# Altium schematic sheet LPDDR4 SDRAM - 1.SchDoc: RK3399 SOM Module
size A3; Date: 23.05.2023; Author: Łukasz Nowarkiewicz; SheetNumber: 1; SheetTotal: 21; RegistrationBookNumber: 144201; title_sheet: LPDDR4 SDRAM - 1
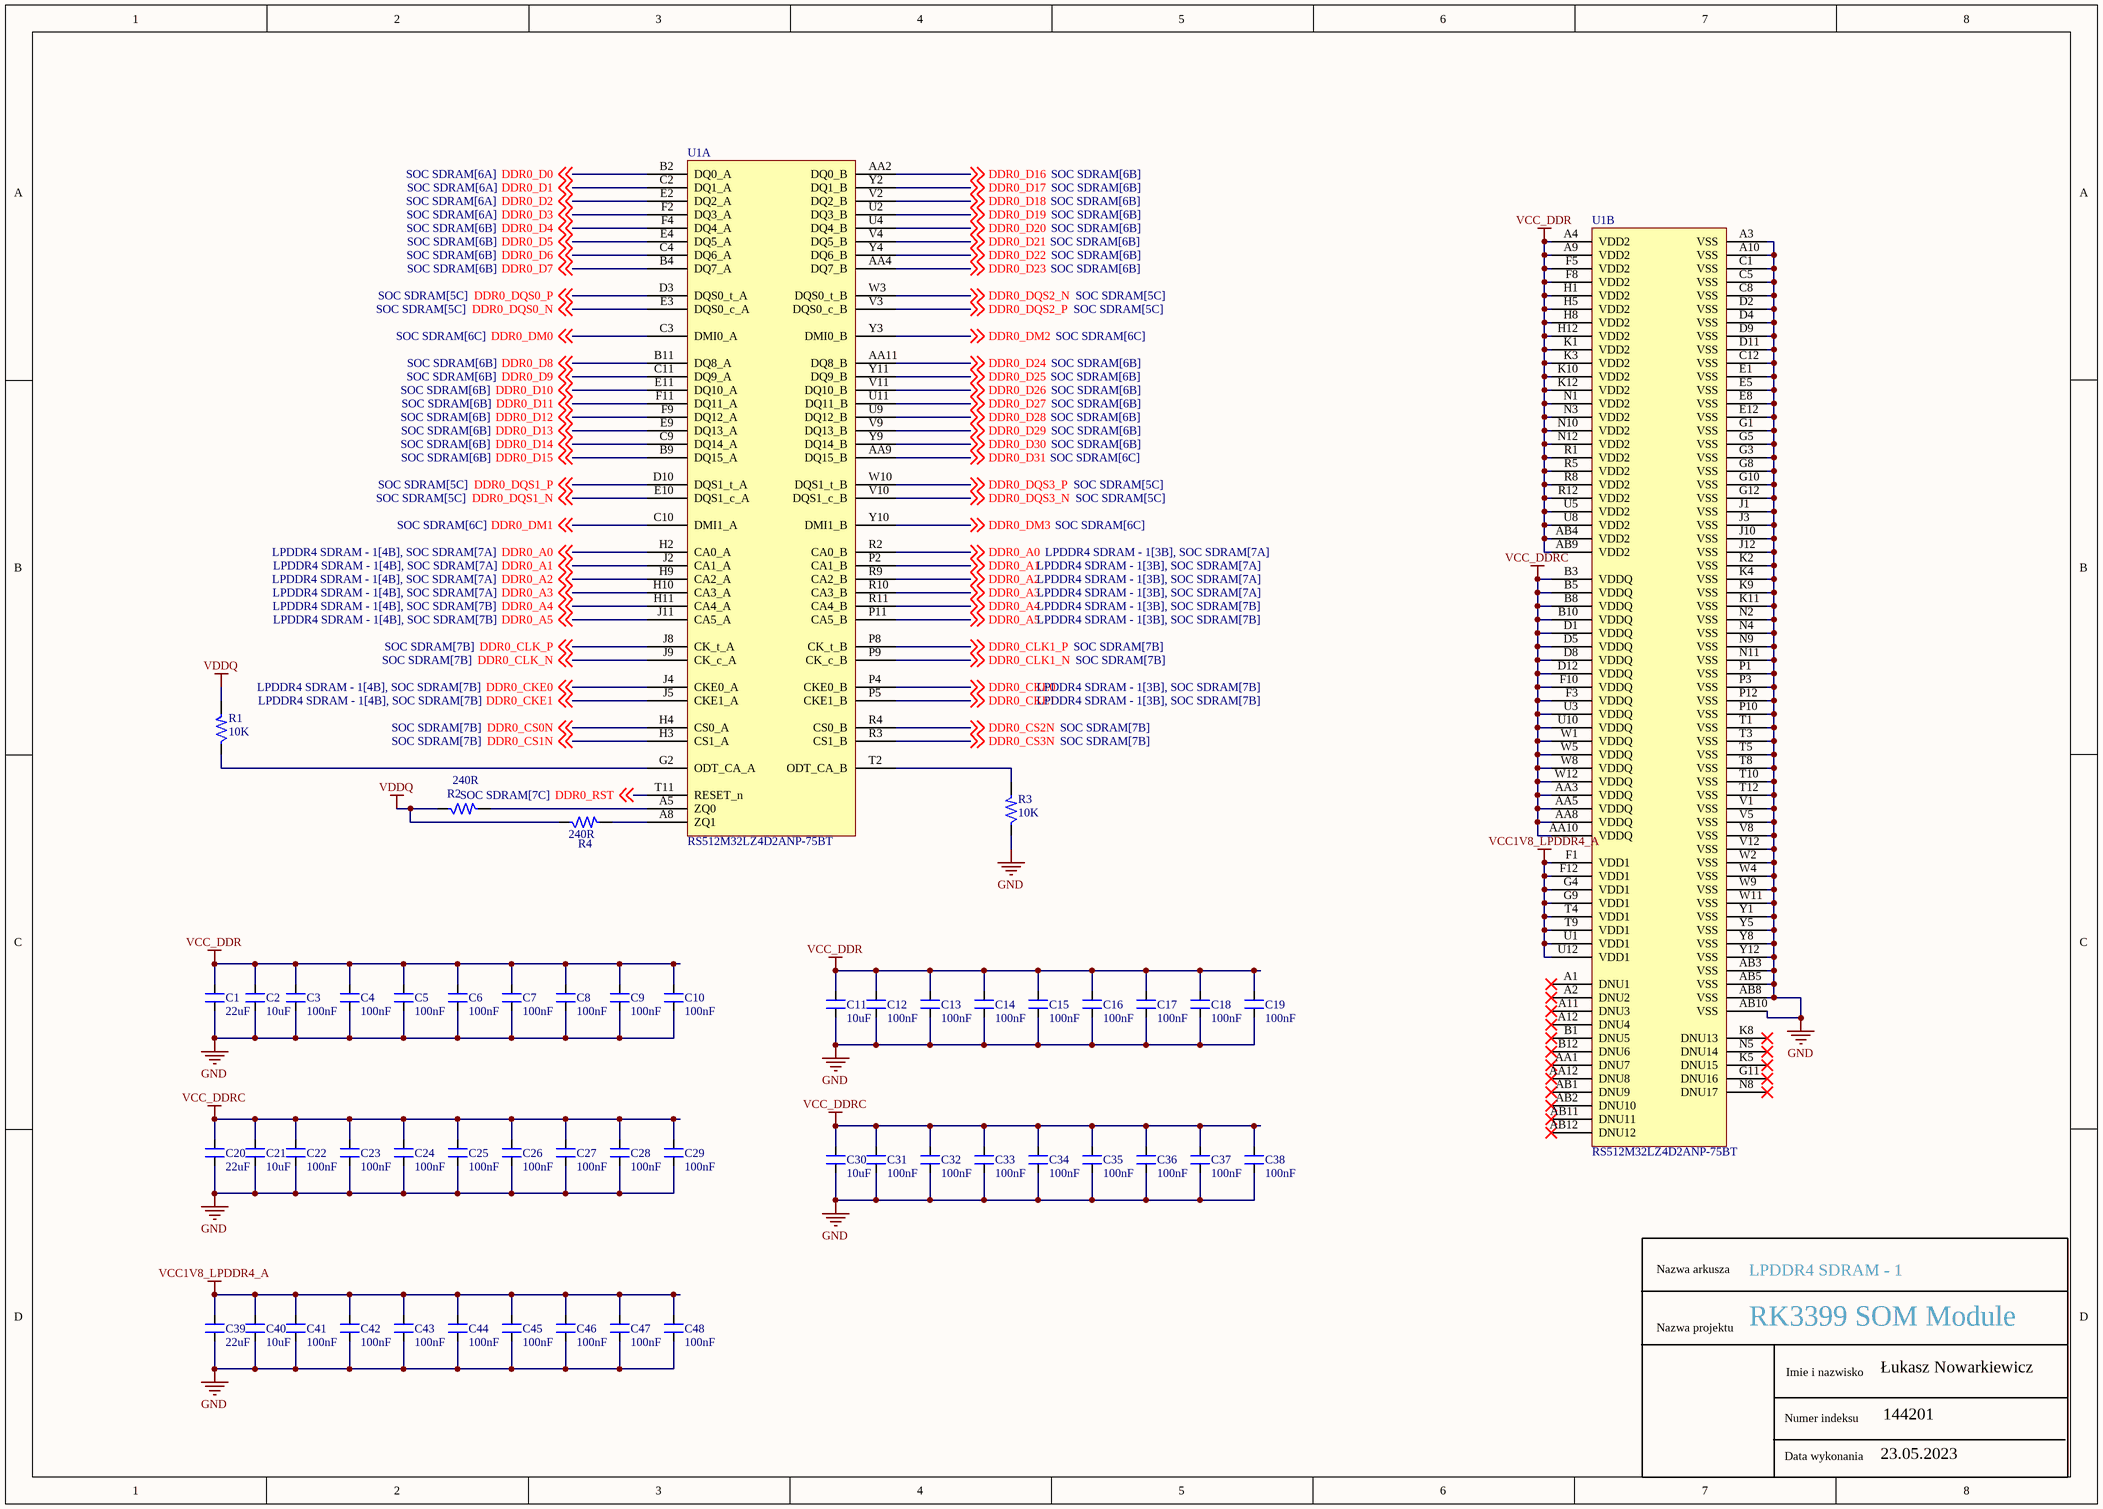
[diagram p0: LPDDR4 SDRAM - 1.SchDoc]

## Parts
C1  22uF  [CAP_0603]
C2  10uF  [CAP_0603]
C3  100nF  [CAP_0402]
C4  100nF  [CAP_0402]
C5  100nF  [CAP_0402]
C6  100nF  [CAP_0402]
C7  100nF  [CAP_0402]
C8  100nF  [CAP_0402]
C9  100nF  [CAP_0402]
C10  100nF  [CAP_0402]
C11  10uF  [CAP_0603]
C12  100nF  [CAP_0402]
C13  100nF  [CAP_0402]
C14  100nF  [CAP_0402]
C15  100nF  [CAP_0402]
C16  100nF  [CAP_0402]
C17  100nF  [CAP_0402]
C18  100nF  [CAP_0402]
C19  100nF  [CAP_0402]
C20  22uF  [CAP_0603]
C21  10uF  [CAP_0603]
C22  100nF  [CAP_0402]
C23  100nF  [CAP_0402]
C24  100nF  [CAP_0402]
C25  100nF  [CAP_0402]
C26  100nF  [CAP_0402]
C27  100nF  [CAP_0402]
C28  100nF  [CAP_0402]
C29  100nF  [CAP_0402]
C30  10uF  [CAP_0603]
C31  100nF  [CAP_0402]
C32  100nF  [CAP_0402]
C33  100nF  [CAP_0402]
C34  100nF  [CAP_0402]
C35  100nF  [CAP_0402]
C36  100nF  [CAP_0402]
C37  100nF  [CAP_0402]
C38  100nF  [CAP_0402]
C39  22uF  [CAP_0603]
C40  10uF  [CAP_0603]
C41  100nF  [CAP_0402]
C42  100nF  [CAP_0402]
C43  100nF  [CAP_0402]
C44  100nF  [CAP_0402]
C45  100nF  [CAP_0402]
C46  100nF  [CAP_0402]
C47  100nF  [CAP_0402]
C48  100nF  [CAP_0402]
R1  10K  [RES_0201]
R2  240R  [RES_0201]
R3  10K  [RES_0201]
R4  240R  [RES_0201]
U1  RS512M32LZ4D2ANP-75BT  [FBGA200_SMD]  (parts A,B of 2)

## Nets
GND: C1.1 C2.1 C3.1 C4.1 C5.1 C6.1 C7.1 C8.1 C9.1 C10.1 C11.1 C12.1 C13.1 C14.1 C15.1 C16.1 C17.1 C18.1 C19.1 C20.1 C21.1 C22.1 C23.1 C24.1 C25.1 C26.1 C27.1 C28.1 C29.1 C30.1 C31.1 C32.1 C33.1 C34.1 C35.1 C36.1 C37.1 C38.1 C39.1 C40.1 C41.1 C42.1 C43.1 C44.1 C45.1 C46.1 C47.1 C48.1 R3.1 U1.A3(VSS) U1.A10(VSS) U1.AB3(VSS) U1.AB5(VSS) U1.AB8(VSS) U1.AB10(VSS) U1.C1(VSS) U1.C5(VSS) U1.C8(VSS) U1.C12(VSS) U1.D2(VSS) U1.D4(VSS) U1.D9(VSS) U1.D11(VSS) U1.E1(VSS) U1.E5(VSS) U1.E8(VSS) U1.E12(VSS) U1.G1(VSS) U1.G3(VSS) U1.G5(VSS) U1.G8(VSS) U1.G10(VSS) U1.G12(VSS) U1.J1(VSS) U1.J3(VSS) U1.J10(VSS) U1.J12(VSS) U1.K2(VSS) U1.K4(VSS) U1.K9(VSS) U1.K11(VSS) U1.N2(VSS) U1.N4(VSS) U1.N9(VSS) U1.N11(VSS) U1.P1(VSS) U1.P3(VSS) U1.P10(VSS) U1.P12(VSS) U1.T1(VSS) U1.T3(VSS) U1.T5(VSS) U1.T8(VSS) U1.T10(VSS) U1.T12(VSS) U1.V1(VSS) U1.V5(VSS) U1.V8(VSS) U1.V12(VSS) U1.W2(VSS) U1.W4(VSS) U1.W9(VSS) U1.W11(VSS) U1.Y1(VSS) U1.Y5(VSS) U1.Y8(VSS) U1.Y12(VSS)
VCC1V8_LPDDR4_A: C39.2 C40.2 C41.2 C42.2 C43.2 C44.2 C45.2 C46.2 C47.2 C48.2 U1.F1(VDD1) U1.F12(VDD1) U1.G4(VDD1) U1.G9(VDD1) U1.T4(VDD1) U1.T9(VDD1) U1.U1(VDD1) U1.U12(VDD1)
VCC_DDR: C1.2 C2.2 C3.2 C4.2 C5.2 C6.2 C7.2 C8.2 C9.2 C10.2 C11.2 C12.2 C13.2 C14.2 C15.2 C16.2 C17.2 C18.2 C19.2 U1.A4(VDD2) U1.A9(VDD2) U1.AB4(VDD2) U1.AB9(VDD2) U1.F5(VDD2) U1.F8(VDD2) U1.H1(VDD2) U1.H5(VDD2) U1.H8(VDD2) U1.H12(VDD2) U1.K1(VDD2) U1.K3(VDD2) U1.K10(VDD2) U1.K12(VDD2) U1.N1(VDD2) U1.N3(VDD2) U1.N10(VDD2) U1.N12(VDD2) U1.R1(VDD2) U1.R5(VDD2) U1.R8(VDD2) U1.R12(VDD2) U1.U5(VDD2) U1.U8(VDD2)
VCC_DDRC: C20.2 C21.2 C22.2 C23.2 C24.2 C25.2 C26.2 C27.2 C28.2 C29.2 C30.2 C31.2 C32.2 C33.2 C34.2 C35.2 C36.2 C37.2 C38.2 U1.AA3(VDDQ) U1.AA5(VDDQ) U1.AA8(VDDQ) U1.AA10(VDDQ) U1.B3(VDDQ) U1.B5(VDDQ) U1.B8(VDDQ) U1.B10(VDDQ) U1.D1(VDDQ) U1.D5(VDDQ) U1.D8(VDDQ) U1.D12(VDDQ) U1.F3(VDDQ) U1.F10(VDDQ) U1.U3(VDDQ) U1.U10(VDDQ) U1.W1(VDDQ) U1.W5(VDDQ) U1.W8(VDDQ) U1.W12(VDDQ)
VDDQ: R1.2 R2.1 R4.1
DDR0_A0: U1.H2(CA0_A) U1.R2(CA0_B) ; off-sheet DDR0_A0
DDR0_A1: U1.J2(CA1_A) U1.P2(CA1_B) ; off-sheet DDR0_A1
DDR0_A2: U1.H9(CA2_A) U1.R9(CA2_B) ; off-sheet DDR0_A2
DDR0_A3: U1.H10(CA3_A) U1.R10(CA3_B) ; off-sheet DDR0_A3
DDR0_A4: U1.H11(CA4_A) U1.R11(CA4_B) ; off-sheet DDR0_A4
DDR0_A5: U1.J11(CA5_A) U1.P11(CA5_B) ; off-sheet DDR0_A5
DDR0_CKE0: U1.J4(CKE0_A) U1.P4(CKE0_B) ; off-sheet DDR0_CKE0
DDR0_CKE1: U1.J5(CKE1_A) U1.P5(CKE1_B) ; off-sheet DDR0_CKE1
DDR0_CLK1_N: U1.P9(CK_c_B) ; off-sheet DDR0_CLK1_N
DDR0_CLK1_P: U1.P8(CK_t_B) ; off-sheet DDR0_CLK1_P
DDR0_CLK_N: U1.J9(CK_c_A) ; off-sheet DDR0_CLK_N
DDR0_CLK_P: U1.J8(CK_t_A) ; off-sheet DDR0_CLK_P
DDR0_CS0N: U1.H4(CS0_A) ; off-sheet DDR0_CS0N
DDR0_CS1N: U1.H3(CS1_A) ; off-sheet DDR0_CS1N
DDR0_CS2N: U1.R4(CS0_B) ; off-sheet DDR0_CS2N
DDR0_CS3N: U1.R3(CS1_B) ; off-sheet DDR0_CS3N
DDR0_D0: U1.B2(DQ0_A) ; off-sheet DDR0_D0
DDR0_D1: U1.C2(DQ1_A) ; off-sheet DDR0_D1
DDR0_D2: U1.E2(DQ2_A) ; off-sheet DDR0_D2
DDR0_D3: U1.F2(DQ3_A) ; off-sheet DDR0_D3
DDR0_D4: U1.F4(DQ4_A) ; off-sheet DDR0_D4
DDR0_D5: U1.E4(DQ5_A) ; off-sheet DDR0_D5
DDR0_D6: U1.C4(DQ6_A) ; off-sheet DDR0_D6
DDR0_D7: U1.B4(DQ7_A) ; off-sheet DDR0_D7
DDR0_D8: U1.B11(DQ8_A) ; off-sheet DDR0_D8
DDR0_D9: U1.C11(DQ9_A) ; off-sheet DDR0_D9
DDR0_D10: U1.E11(DQ10_A) ; off-sheet DDR0_D10
DDR0_D11: U1.F11(DQ11_A) ; off-sheet DDR0_D11
DDR0_D12: U1.F9(DQ12_A) ; off-sheet DDR0_D12
DDR0_D13: U1.E9(DQ13_A) ; off-sheet DDR0_D13
DDR0_D14: U1.C9(DQ14_A) ; off-sheet DDR0_D14
DDR0_D15: U1.B9(DQ15_A) ; off-sheet DDR0_D15
DDR0_D16: U1.AA2(DQ0_B) ; off-sheet DDR0_D16
DDR0_D17: U1.Y2(DQ1_B) ; off-sheet DDR0_D17
DDR0_D18: U1.V2(DQ2_B) ; off-sheet DDR0_D18
DDR0_D19: U1.U2(DQ3_B) ; off-sheet DDR0_D19
DDR0_D20: U1.U4(DQ4_B) ; off-sheet DDR0_D20
DDR0_D21: U1.V4(DQ5_B) ; off-sheet DDR0_D21
DDR0_D22: U1.Y4(DQ6_B) ; off-sheet DDR0_D22
DDR0_D23: U1.AA4(DQ7_B) ; off-sheet DDR0_D23
DDR0_D24: U1.AA11(DQ8_B) ; off-sheet DDR0_D24
DDR0_D25: U1.Y11(DQ9_B) ; off-sheet DDR0_D25
DDR0_D26: U1.V11(DQ10_B) ; off-sheet DDR0_D26
DDR0_D27: U1.U11(DQ11_B) ; off-sheet DDR0_D27
DDR0_D28: U1.U9(DQ12_B) ; off-sheet DDR0_D28
DDR0_D29: U1.V9(DQ13_B) ; off-sheet DDR0_D29
DDR0_D30: U1.Y9(DQ14_B) ; off-sheet DDR0_D30
DDR0_D31: U1.AA9(DQ15_B) ; off-sheet DDR0_D31
DDR0_DM0: U1.C3(DMI0_A) ; off-sheet DDR0_DM0
DDR0_DM1: U1.C10(DMI1_A) ; off-sheet DDR0_DM1
DDR0_DM2: U1.Y3(DMI0_B) ; off-sheet DDR0_DM2
DDR0_DM3: U1.Y10(DMI1_B) ; off-sheet DDR0_DM3
DDR0_DQS0_N: U1.E3(DQS0_c_A) ; off-sheet DDR0_DQS0_N
DDR0_DQS0_P: U1.D3(DQS0_t_A) ; off-sheet DDR0_DQS0_P
DDR0_DQS1_N: U1.E10(DQS1_c_A) ; off-sheet DDR0_DQS1_N
DDR0_DQS1_P: U1.D10(DQS1_t_A) ; off-sheet DDR0_DQS1_P
DDR0_DQS2_N: U1.W3(DQS0_t_B) ; off-sheet DDR0_DQS2_N
DDR0_DQS2_P: U1.V3(DQS0_c_B) ; off-sheet DDR0_DQS2_P
DDR0_DQS3_N: U1.V10(DQS1_c_B) ; off-sheet DDR0_DQS3_N
DDR0_DQS3_P: U1.W10(DQS1_t_B) ; off-sheet DDR0_DQS3_P
DDR0_RST: U1.T11(RESET_n) ; off-sheet DDR0_RST
NetR1_1: R1.1 U1.G2(ODT_CA_A)
NetR2_2: R2.2 U1.A5(ZQ0)
NetR3_2: R3.2 U1.T2(ODT_CA_B)
NetR4_2: R4.2 U1.A8(ZQ1)

Not connected (* = marked no-connect by the designer): U1 A1(DNU1)* A2(DNU2)* A11(DNU3)* A12(DNU4)* AA1(DNU7)* AA12(DNU8)* AB1(DNU9)* AB2(DNU10)* AB11(DNU11)* AB12(DNU12)* B1(DNU5)* B12(DNU6)* G11(DNU16)* K5(DNU15)* K8(DNU13)* N5(DNU14)* N8(DNU17)*

## Notes on the sheet
- Nazwa arkusza
- Nazwa projektu
- Imie i nazwisko
- Data wykonania
- Numer indeksu

## Library data of the parts
C1 C20 C39 = CAP_22uF-10V-20%-0603: 22µF ±20% 10V Ceramic Capacitor X5R 0603 (1608 Metric); Manufacturer: Murata Electronics; Manufacturer Part Number: GRM188R61A226ME15D; Case/Package: 0603; Supplier-1: Digikey
C2 C11 C21 C30 C40 = CAP_10uF-10V-10%-0603: 10µF ±10% 10V Ceramic Capacitor X5R 0603 (1608 Metric); Manufacturer Part Number: GRM188R61A106KE69J; Manufacturer: Murata Electronics; Case/Package: 0603; Supplier-1: Digikey
C3-C10 C12-C19 C22-C29 C31-C38 C41-C48 = CAP_100nF-10V-10%-0402: 0.1µF ±10% 10V Ceramic Capacitor X7R 0402 (1005 Metric); Manufacturer: Yageo; Manufacturer Part Number: CC0402KRX7R6BB104; Case/Package: 0402; Supplier-1: Digikey
R1 R3 = RES_10K-0.05W-1%-0201: 10 kOhms ±1% 0.05W, 1/20W Chip Resistor 0201 (0603 Metric) Thick Film; Manufacturer: Stackpole Electronics Inc; Manufacturer Part Number: RMCF0201FT10K0; Case/Package: 0201; Supplier-1: Digikey
R2 R4 = RES_240R-0.05W-1%-0201: 240 Ohms ±1% 0.05W, 1/20W Chip Resistor 0201 (0603 Metric) Thick Film; Manufacturer: Yageo; Manufacturer Part Number: RC0201FR-07240RL; Case/Package: 0201; Supplier-1: Digikey
U1 = IC_RS512M32LZ4D2ANP-75BT: LPDDR4/4X Package FBGA 200b Density 4Gbit~64Gbit Operating Temperature Range：-25~85℃ Speed：2667Mbps/3200Mbps/3733Mbps Voltage：VDD1/VDD2/VDDQ= 1.8 / 1.1 / 1.1 V（LPDDR4）VDD1/VDD2/VDDQ = 1.8 / 1.1 / 0.6 V（LPDDR4X）Approved Verification Platform：MTK、Spreadtrum; Manufacturer: RAYSON; Manufacturer Part Number: RS512M32LZ4D2ANP-75BT; Case/Package: FBGA 200b; Supplier-1: RAYSON